# Altium schematic sheet M.2 Connection.SchDoc
size A4; SheetNumber: 5; SheetTotal: 6
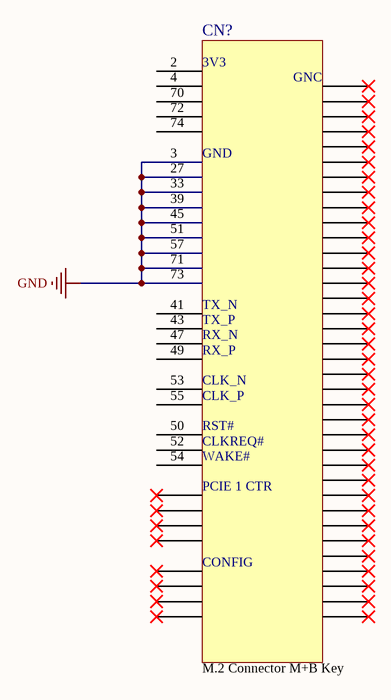
[diagram p0: M.2 Connection.SchDoc]

## Parts
CN?  M.2 Connector M+B Key  [CONN-SMD_91302-32-067RDM]

## Nets
GND: CN?.3 CN?.27 CN?.33 CN?.39 CN?.45 CN?.51 CN?.57 CN?.71 CN?.73

Not connected (* = marked no-connect by the designer): CN? 1 2 4 5 6 7 8 9 10 11 12 13 14 15 16 17 18 19 20 21 22 23 24 25 26 28 29 30 31 32 34 35 36 37 38 40 41 42 43 44 46 47 48 49 50 52 53 54 55 56 58 67 68 69 70 72 74 75

## Notes on the sheet
- (in symbol 91302-42-067RDM) 3V3; GNC; GND; TX_N; TX_P; RX_N; RX_P; CLK_N; CLK_P; RST#; CLKREQ#; WAKE#; PCIE 1 CTR; CONFIG

## Library data of the parts
CN? = 91302-42-067RDM: 67P Surface Mount, Right Angle SMD,P=0.5mm Centronics Connectors RoHS